# EAGLE design G6S-2G-Y (EAGLE 6.5.0)
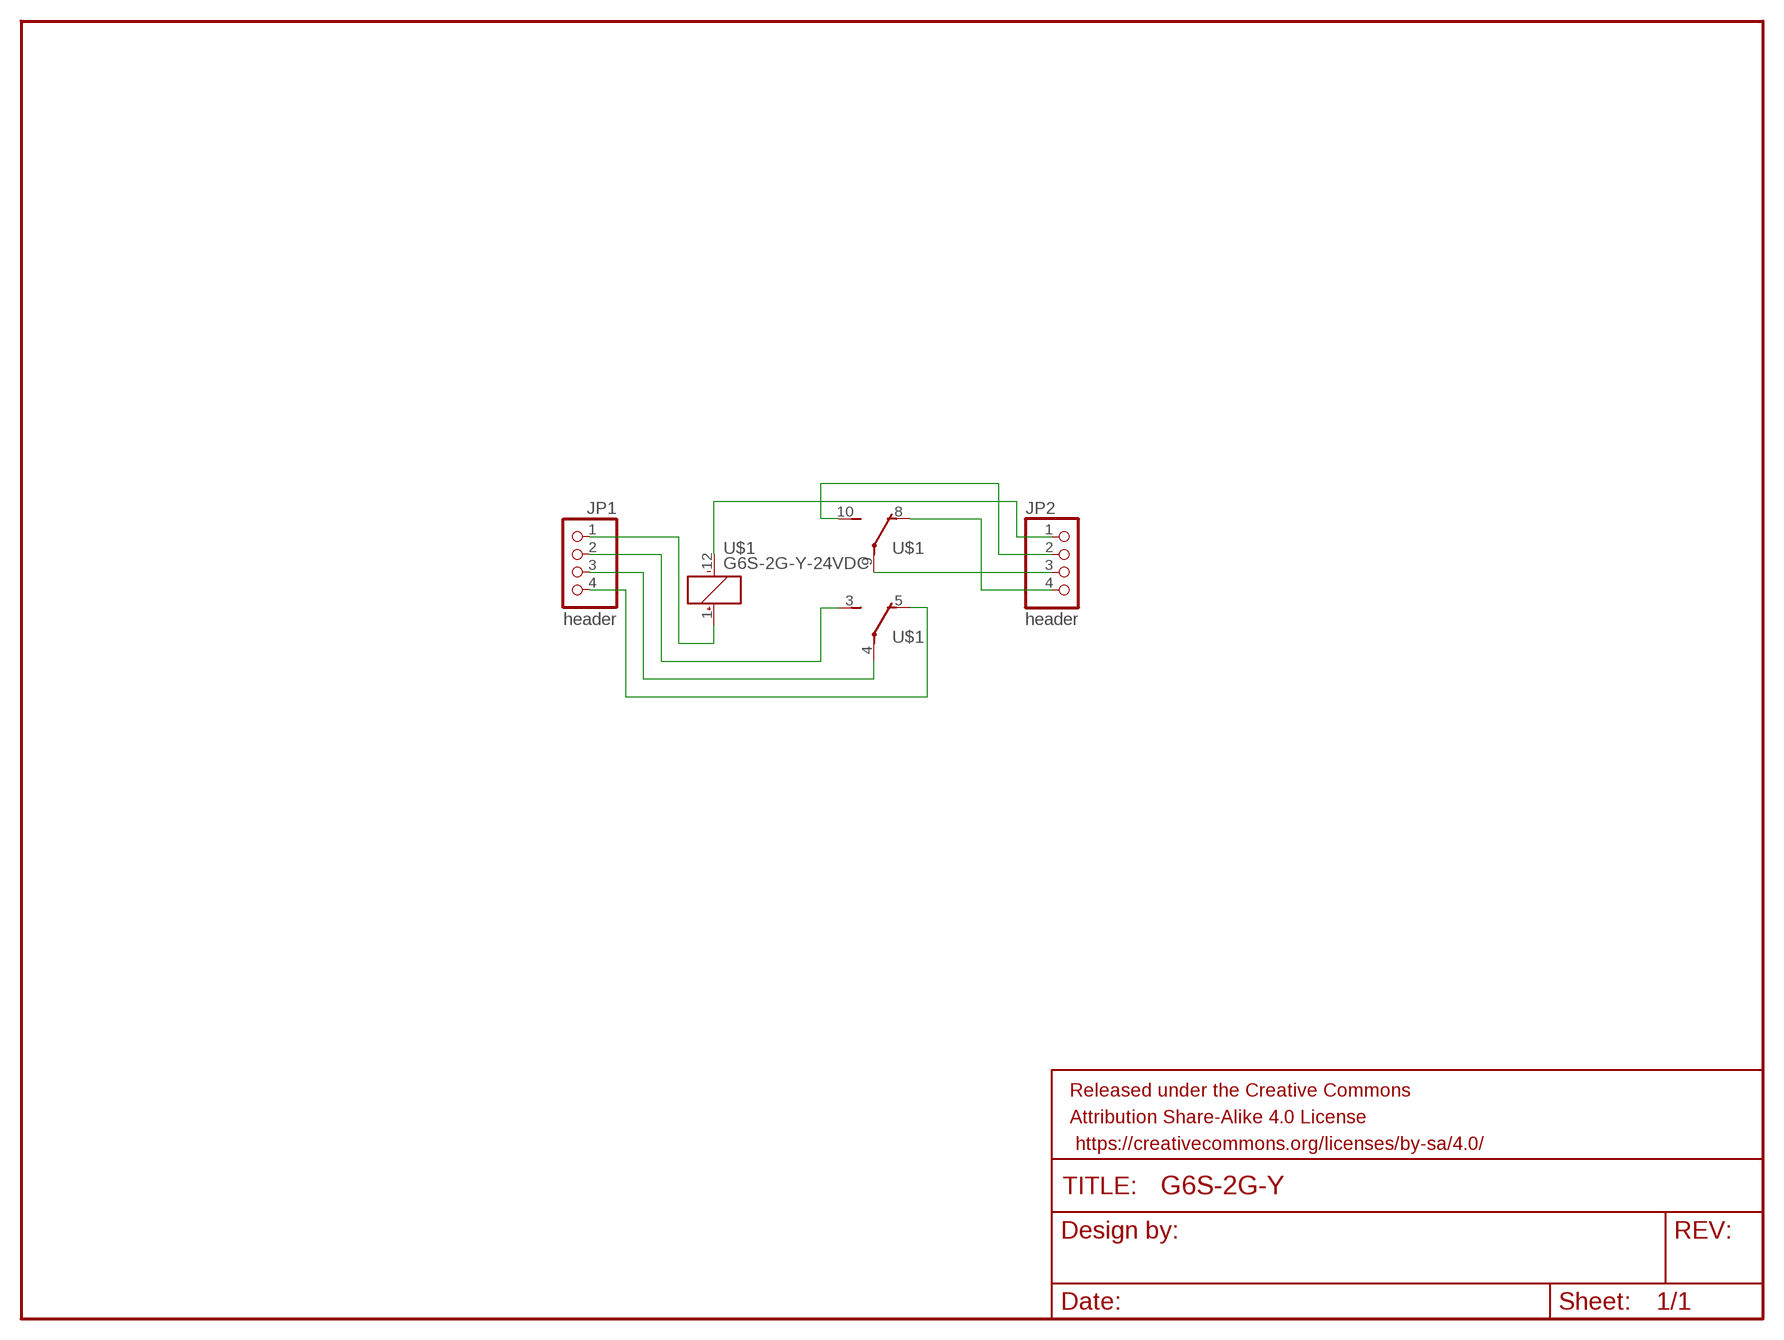
[diagram p0: schematic, sheet 1]

## Parts
FRAME1  FRAME-LETTER  [CREATIVE_COMMONS]
JP1  header  PINHD-1X4  [1X04]
JP2  header  PINHD-1X4  [1X04]
U$1  G6S-2G-Y-24VDC  [G6S-2G-Y-24VDC]

## Nets
N$1: JP1.1 U$1.1(+)
N$2: JP1.2 U$1.3(NO)
N$3: JP1.3 U$1.4(COM)
N$4: JP1.4 U$1.5(NC)
N$5: JP2.1 U$1.12(-)
N$6: JP2.2 U$1.10(NO)
N$7: JP2.3 U$1.9(COM)
N$8: JP2.4 U$1.8(NC)

## Library data of the parts
FRAME1 = SparkFun-Aesthetics:FRAME-LETTER: Schematic Frame Standard 8.5x11 US Letter frame
JP1 JP2 = pinhead:PINHD-1X4: PIN HEADER
U$1 = railman:G6S-2G-Y-24VDC

## Board
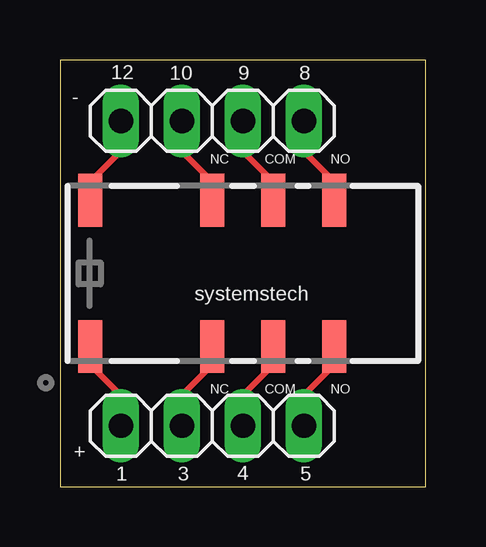
[diagram p1: board, top side]

Size 15.24 x 17.78 mm. Coordinates in mm from the lower left corner, seen from the top.
Outline: 0,0 15.24,0 15.24,17.78 0,17.78 0,0
Copper layers (1*16): Top 0.035mm / dielectric 1.5mm / Bottom 0.035mm
Design rules "default": minimum track width 10mil, minimum drill 0.6mm, track to track 8mil, track to pad 8mil, pad to pad 8mil, via to via 8mil, smd to smd 8mil, copper to edge 40mil, drill to drill 8mil, minimum pad ring 10mil, minimum via ring 8mil, stop-mask expansion 4mil, vias tented up to drill 0mil, thermal gap 10mil

### Footprints (pad centres in the part's own frame; a part is rotated, then mirrored left to right if it is on the bottom)
1X04 = drill 1.016 long: 1 -3.81,0; 2 -1.27,0; 3 1.27,0; 4 3.81,0
G6S-2G-Y-24VDC = smd 1 x 2.2: 1 -6.35,-3.05; 3 -1.27,-3.05; 4 1.27,-3.05; 5 3.81,-3.05; 8 3.81,3.05; 9 1.27,3.05; 10 -1.27,3.05; 12 -6.35,3.05

### Placement (x,y rotation side)
FRAME1  20.32,-10.16 0 top  (outside the outline)
JP1  6.35,2.54 0 top
JP2  6.35,15.24 0 top
U$1  7.62,8.89 0 top

### Tracks (layer width: path | path; a pad name or v marks a point on that pad's centre or on a via)
N$1
  Top 0.254: JP1.1 2.54,3.81 1.27,5.08 U$1.1
N$2
  Top 0.254: JP1.2 5.08,3.81 6.35,5.08 U$1.3
N$3
  Top 0.254: JP1.3 7.62,3.81 8.89,5.08 U$1.4
N$4
  Top 0.254: JP1.4 10.16,3.81 11.43,5.08 U$1.5
N$5
  Top 0.254: JP2.1 2.54,13.97 1.27,12.7 U$1.12
N$6
  Top 0.254: JP2.2 5.08,13.97 6.35,12.7 U$1.10
N$7
  Top 0.254: JP2.3 7.62,13.97 8.89,12.7 U$1.9
N$8
  Top 0.254: JP2.4 10.16,13.97 11.43,12.7 U$1.8

### Text on the board
tDocu: systemstech
_tsilk: 12 | 10 | 9 | 8 | - | systemstech | + | 1 | 3 | 4 | 5